# Altium schematic sheet Alarm_projekt.SchDoc: CPU board
size A4; Date: 8.11.2020; DrawnBy: Borna Barisic; SheetNumber: 1; ProjectName: Alarm radiona
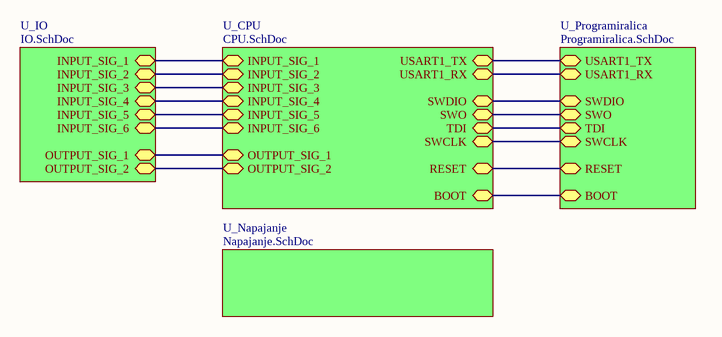
[diagram p0: Alarm_projekt.SchDoc]

## Sub-sheets
U_CPU = CPU.SchDoc: INPUT_SIG_1 (bidir), INPUT_SIG_2 (bidir), INPUT_SIG_3 (bidir), INPUT_SIG_4 (bidir), INPUT_SIG_5 (bidir), INPUT_SIG_6 (bidir), OUTPUT_SIG_1 (bidir), OUTPUT_SIG_2 (bidir), USART1_TX (bidir), USART1_RX (bidir), BOOT (bidir), RESET (bidir), SWDIO (bidir), SWO (bidir), SWCLK (bidir), TDI (bidir)
U_IO = IO.SchDoc: INPUT_SIG_1 (bidir), INPUT_SIG_2 (bidir), INPUT_SIG_3 (bidir), INPUT_SIG_4 (bidir), INPUT_SIG_5 (bidir), INPUT_SIG_6 (bidir), OUTPUT_SIG_1 (bidir), OUTPUT_SIG_2 (bidir)
U_Napajanje = Napajanje.SchDoc: no entries
U_Programiralica = Programiralica.SchDoc: USART1_TX (bidir), USART1_RX (bidir), BOOT (bidir), RESET (bidir), TDI (bidir), SWDIO (bidir), SWO (bidir), SWCLK (bidir)

## Nets
(unnamed): sheet U_CPU/INPUT_SIG_1, sheet U_IO/INPUT_SIG_1
(unnamed): sheet U_CPU/INPUT_SIG_2, sheet U_IO/INPUT_SIG_2
(unnamed): sheet U_CPU/INPUT_SIG_3, sheet U_IO/INPUT_SIG_3
(unnamed): sheet U_CPU/INPUT_SIG_4, sheet U_IO/INPUT_SIG_4
(unnamed): sheet U_CPU/INPUT_SIG_5, sheet U_IO/INPUT_SIG_5
(unnamed): sheet U_CPU/INPUT_SIG_6, sheet U_IO/INPUT_SIG_6
(unnamed): sheet U_CPU/OUTPUT_SIG_1, sheet U_IO/OUTPUT_SIG_1
(unnamed): sheet U_CPU/OUTPUT_SIG_2, sheet U_IO/OUTPUT_SIG_2
(unnamed): sheet U_CPU/USART1_TX, sheet U_Programiralica/USART1_TX
(unnamed): sheet U_CPU/USART1_RX, sheet U_Programiralica/USART1_RX
(unnamed): sheet U_CPU/BOOT, sheet U_Programiralica/BOOT
(unnamed): sheet U_CPU/RESET, sheet U_Programiralica/RESET
(unnamed): sheet U_CPU/SWDIO, sheet U_Programiralica/SWDIO
(unnamed): sheet U_CPU/SWO, sheet U_Programiralica/SWO
(unnamed): sheet U_CPU/SWCLK, sheet U_Programiralica/SWCLK
(unnamed): sheet U_CPU/TDI, sheet U_Programiralica/TDI